# EAGLE design Slipring Brush (EAGLE 9.5.2)
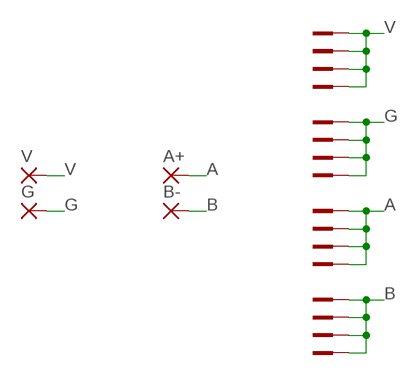
[diagram p0: schematic, sheet 1]

## Parts
A+  SMD2  [SMD1,27-2,54]
B-  SMD2  [SMD1,27-2,54]
G  SMD2  [SMD1,27-2,54]
U$1  POGOPIN_A585  [POGOPIN_A585]
U$2  POGOPIN_A585  [POGOPIN_A585]
U$3  POGOPIN_A585  [POGOPIN_A585]
U$4  POGOPIN_A585  [POGOPIN_A585]
U$5  POGOPIN_A585  [POGOPIN_A585]
U$6  POGOPIN_A585  [POGOPIN_A585]
U$7  POGOPIN_A585  [POGOPIN_A585]
U$8  POGOPIN_A585  [POGOPIN_A585]
U$9  POGOPIN_A585  [POGOPIN_A585]
U$10  POGOPIN_A585  [POGOPIN_A585]
U$11  POGOPIN_A585  [POGOPIN_A585]
U$12  POGOPIN_A585  [POGOPIN_A585]
U$13  POGOPIN_A585  [POGOPIN_A585]
U$14  POGOPIN_A585  [POGOPIN_A585]
U$15  POGOPIN_A585  [POGOPIN_A585]
U$16  POGOPIN_A585  [POGOPIN_A585]
V  SMD2  [SMD1,27-2,54]

## Nets
A [SIG]: A+.1(P) U$9.P$1(KL) U$9.P$2(KL) U$9.P$3(KL) U$10.P$1(KL) U$10.P$2(KL) U$10.P$3(KL) U$11.P$1(KL) U$11.P$2(KL) U$11.P$3(KL) U$12.P$1(KL) U$12.P$2(KL) U$12.P$3(KL)
B [SIG]: B-.1(P) U$13.P$1(KL) U$13.P$2(KL) U$13.P$3(KL) U$14.P$1(KL) U$14.P$2(KL) U$14.P$3(KL) U$15.P$1(KL) U$15.P$2(KL) U$15.P$3(KL) U$16.P$1(KL) U$16.P$2(KL) U$16.P$3(KL)
G: G.1(P) U$5.P$1(KL) U$5.P$2(KL) U$5.P$3(KL) U$6.P$1(KL) U$6.P$2(KL) U$6.P$3(KL) U$7.P$1(KL) U$7.P$2(KL) U$7.P$3(KL) U$8.P$1(KL) U$8.P$2(KL) U$8.P$3(KL)
V: U$1.P$1(KL) U$1.P$2(KL) U$1.P$3(KL) U$2.P$1(KL) U$2.P$2(KL) U$2.P$3(KL) U$3.P$1(KL) U$3.P$2(KL) U$3.P$3(KL) U$4.P$1(KL) U$4.P$2(KL) U$4.P$3(KL) V.1(P)

## Library data of the parts
A+ B- G V = wirepad:SMD2: SMD PAD
U$1-U$16 = customCON:POGOPIN_A585

## Net classes
0 POWER: width 1.27 mm, drill 0.305 mm, clearance 0.152 mm
1 SIG: width 0.635 mm, drill 0.305 mm, clearance 0.152 mm

## Board
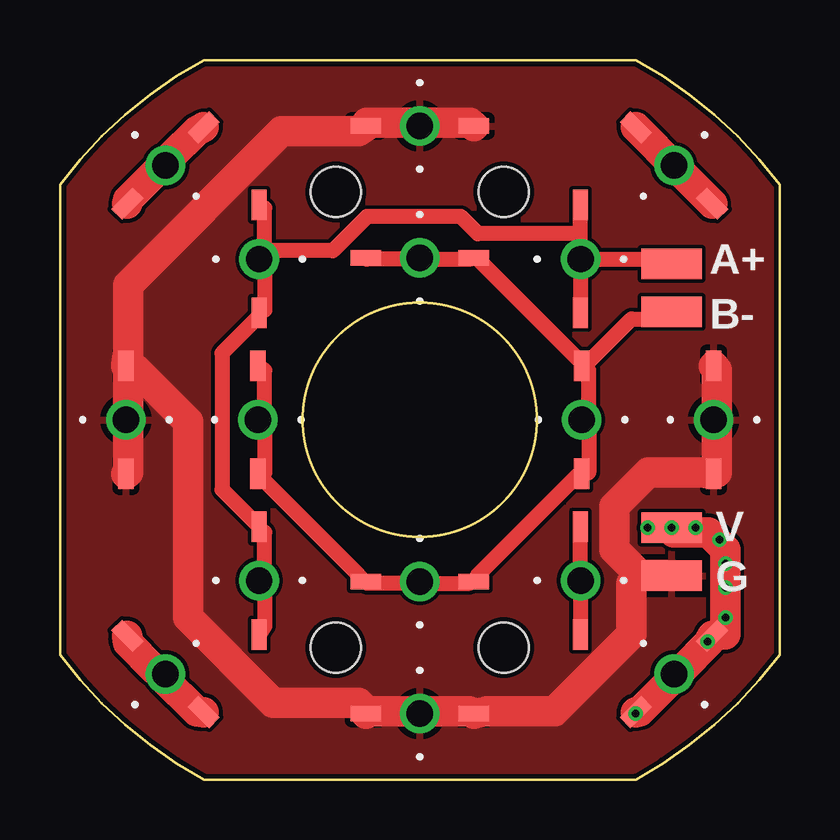
[diagram p1: board, top side]
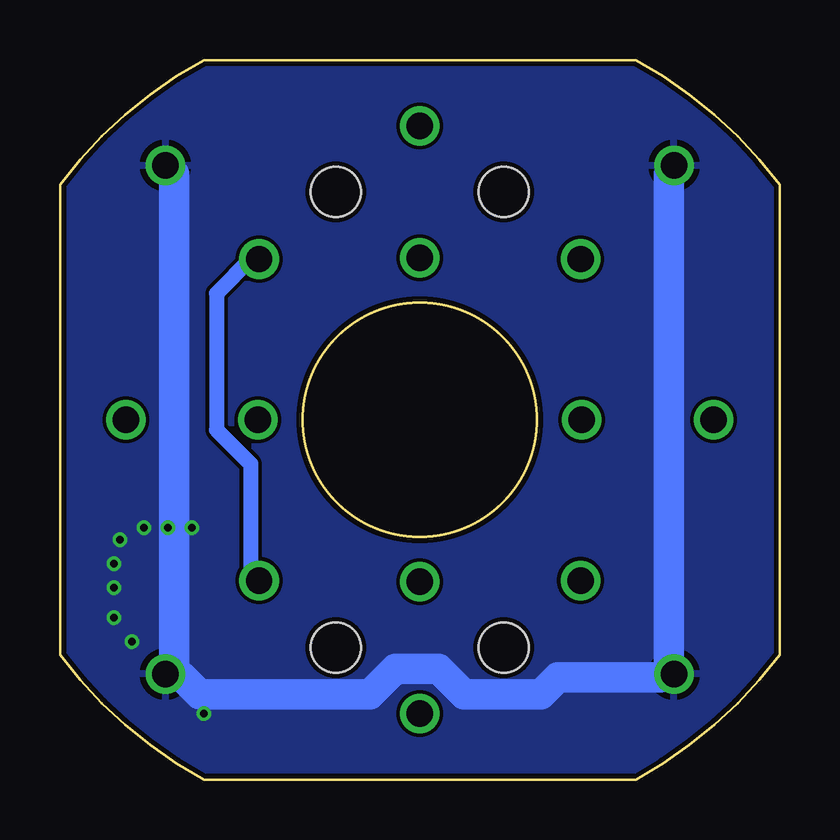
[diagram p2: board, bottom side, seen from below]

Size 30 x 30 mm. Coordinates in mm from the lower left corner, seen from the top.
Outline: 6,0 24,0 arc24 30,5.2 30,24.8 arc24 24,30 6,30 arc24 0,24.8 0,5.2 arc24 6,0
Outline: circle at 15,15 radius 4.88
Copper layers (1*16): Top 0.035mm / dielectric 1.53mm / Bottom 0.035mm
Design rules "default *": minimum track width 6mil, minimum drill 0.3mm, track to track 6mil, track to pad 6mil, pad to pad 6mil, via to via 6mil, smd to smd 0mil, copper to edge 8mil, drill to drill 10mil, minimum pad ring 10mil, minimum via ring 6mil, stop-mask expansion 4mil, vias tented up to drill 12mil, thermal gap 10mil
Holes 2.1 mm at 11.5,5.5 18.5,5.5 18.5,24.5 11.5,24.5

### Footprints (pad centres in the part's own frame; a part is rotated, then mirrored left to right if it is on the bottom)
SMD1,27-2,54 = smd 1.27 x 2.54: 1 0,0
POGOPIN_A585 = drill 1.1: P$1 0,0 | smd 1.27 x 0.635: P$2 -2.25,0; P$3 2.25,0

### Placement (x,y rotation side)
A+  25.5,21.5 270 top
B-  25.5,19.5 270 top
G  25.5,8.5 270 top
U$1  25.6,25.6 135 top
U$2  25.6,4.4 45 top
U$3  4.4,25.6 45 top
U$4  4.4,4.4 135 top
U$5  15,27.25 0 top
U$6  15,2.75 0 top
U$7  2.75,15 90 top
U$8  27.25,15 90 top
U$9  21.7,21.7 90 top
U$10  21.7,8.3 270 top
U$11  8.3,21.7 90 top
U$12  8.3,8.3 90 top
U$13  15,21.75 0 top
U$14  15,8.25 0 top
U$15  21.75,15 90 top
U$16  8.25,15 90 top
V  25.5,10.5 270 top

### Tracks (layer width: path | path; a pad name or v marks a point on that pad's centre or on a via)
A
  Top 0.635: U$12.P$2 8.53,6.4 8.53,8.18 U$12.P$1 8.53,8.53 8.53,10.31 U$12.P$3 8.18,10.67 6.76,12.09 6.76,17.78 8.18,19.2 U$11.P$2 8.53,19.56 8.53,21.69 U$11.P$1 8.53,22.05 | 8.53,22.05 8.53,23.82 U$11.P$3 | U$10.P$3 21.69,6.4 21.69,8.18 U$10.P$1 21.69,8.53 21.69,10.31 U$10.P$2 | U$9.P$2 21.69,19.56 U$9.P$1 | 21.69,22.76 21.69,22.05 U$9.P$1 | 21.69,22.76 21.69,23.82 U$9.P$3 | A+.1 25.25,21.69 22.05,21.69 U$9.P$1 | 8.53,22.05 11.38,22.05 12.8,23.47 16.71,23.47 17.42,22.76 21.69,22.76
  Bottom 0.635: U$10.P$1 22.05,8.53 22.05,13.16 23.47,14.58 23.47,20.27 22.05,21.69 U$9.P$1
B
  Top 0.635: U$16.P$3 8.53,17.07 8.53,15.29 U$16.P$1 8.53,14.94 8.53,12.8 U$16.P$2 8.53,12.45 12.45,8.53 U$14.P$2 12.8,8.18 14.94,8.18 U$14.P$1 15.29,8.18 17.07,8.18 U$14.P$3 17.42,8.53 21.69,12.8 U$15.P$2 22.05,12.8 22.05,14.94 U$15.P$1 22.05,15.29 22.05,17.07 U$15.P$3 | U$13.P$2 12.8,21.69 14.94,21.69 U$13.P$1 15.29,21.69 17.07,21.69 U$13.P$3 17.42,21.69 21.69,17.42 U$15.P$3 | B-.1 25.25,19.2 23.82,19.2 22.05,17.42 U$15.P$3
G
  Top 1.27: U$7.P$2 2.85,12.8 2.85,14.94 U$7.P$1 2.85,15.29 2.85,17.07 | 2.85,17.07 U$7.P$3 2.85,17.78 2.85,20.62 9.25,27.03 12.45,27.03 U$5.P$2 12.8,27.38 14.94,27.38 U$5.P$1 15.29,27.38 17.07,27.38 U$5.P$3 | 12.8,2.85 14.94,2.85 U$6.P$1 15.29,2.85 17.07,2.85 U$6.P$3 17.78,2.85 20.62,2.85 23.82,6.04 23.82,8.18 24.18,8.53 | 12.8,2.85 U$6.P$2 | U$8.P$3 27.38,17.07 27.38,15.29 U$8.P$1 27.38,14.94 27.38,12.8 U$8.P$2 26.67,12.8 24.54,12.8 23.11,11.38 23.11,9.6 24.18,8.53 | 24.18,8.53 25.25,8.53 G.1 | 2.85,17.07 3.2,17.07 5.33,14.94 5.33,6.76 8.89,3.2 12.45,3.2 12.8,2.85
  pour Top: -1,31 31,31 31,-1 -1,-1
V  (via drill 0.3)
  Top 1.27: U$4.P$2 5.69,2.85 4.27,4.27 U$4.P$1 3.91,4.62 2.85,5.69 U$4.P$3 | U$3.P$2 2.85,24.18 4.27,25.6 U$3.P$1 4.62,25.96 5.69,27.03 U$3.P$3 | U$1.P$3 24.18,27.03 U$1.P$1 25.96,25.25 27.03,24.18 U$1.P$2 | U$2.P$2 24.18,2.85 25.6,4.27 U$2.P$1 25.96,4.62 27.03,5.69 U$2.P$3 27.74,6.04 27.74,9.6 27.03,10.31 25.6,10.31 V.1
  Bottom 1.27: U$3.P$1 4.62,25.25 4.62,4.62 U$4.P$1 4.98,4.27 9.25,4.27 9.96,3.56 13.16,3.56 14.22,4.62 16,4.62 17.07,3.56 24.18,3.56 24.89,4.27 U$2.P$1 25.25,4.62 25.25,25.25 U$1.P$1
  other vias: 25.5,10.5 24.5,10.5 26.5,10.5 27.5,10 27.75,9 27.75,8 27.75,6.75 27,5.75 24,2.75
  pour Bottom: -0.5,-0.5 30.5,-0.5 30.5,30.5 -0.5,30.5